# Altium schematic sheet SENSE AMP - 4 CH.SchDoc
size B; Organization: Altium Limited; Address1: L3, 12a Rodborough Rd; Address2: Frenchs Forest; Address3: NSW; Address4: Australia 2086
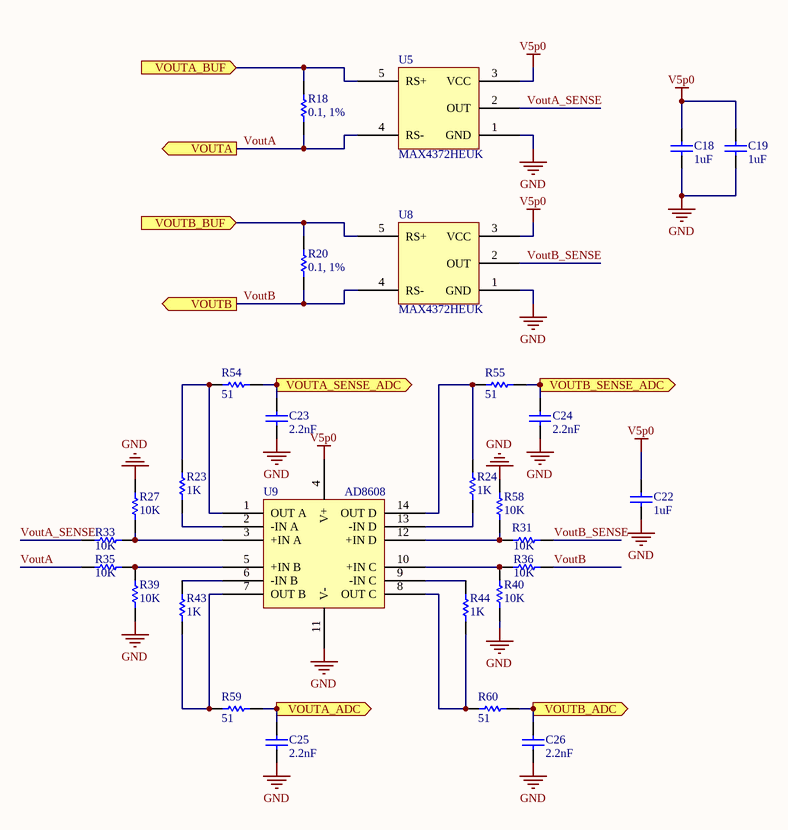
[diagram p0: SENSE AMP - 4 CH.SchDoc]

## Parts
C18  value 1uF  [CAPC01005(0402)22_N]  (hidden comment: CAP, 0402, 1uF)
C19  value 1uF  [CAPC01005(0402)22_N]  (hidden comment: CAP, 0402, 1uF)
C22  value 1uF  [CAPC01005(0402)22_N]  (hidden comment: CAP, 0402, 1uF)
C23  value 2.2nF  [CAPC01005(0402)22_N]  (hidden comment: CAP, 0402, 2.2nF)
C24  value 2.2nF  [CAPC01005(0402)22_N]  (hidden comment: CAP, 0402, 2.2nF)
C25  value 2.2nF  [CAPC01005(0402)22_N]  (hidden comment: CAP, 0402, 2.2nF)
C26  value 2.2nF  [CAPC01005(0402)22_N]  (hidden comment: CAP, 0402, 2.2nF)
R18  value 0.1, 1%  [RES, 0603]  (hidden comment: RES, 0603, 0.1, 1%)
R20  value 0.1, 1%  [RES, 0603]  (hidden comment: RES, 0603, 0.1, 1%)
R23  1K  [RES, 0603]
R24  1K  [RES, 0603]
R27  10K  [RES, 0603]
R31  10K  [RES, 0603]
R33  10K  [RES, 0603]
R35  10K  [RES, 0603]
R36  10K  [RES, 0603]
R39  10K  [RES, 0603]
R40  10K  [RES, 0603]
R43  1K  [RES, 0603]
R44  1K  [RES, 0603]
R54  51  [RES, 0603]
R55  51  [RES, 0603]
R58  10K  [RES, 0603]
R59  51  [RES, 0603]
R60  51  [RES, 0603]
U5  MAX4372HEUK  [SOT23-5, MAX4372H]
U8  MAX4372HEUK  [SOT23-5, MAX4372H]
U9  AD8608  [TSOP65P640X120-14N]

## Ports
VOUTA (out), VOUTA_ADC (out), VOUTA_BUF (in), VOUTA_SENSE_ADC (out), VOUTB (out), VOUTB_ADC (out), VOUTB_BUF (in), VOUTB_SENSE_ADC (out)

## Nets
GND: C18.1 C19.1 C22.1 C23.1 C24.1 C25.1 C26.1 R27.2 R39.1 R40.2 R58.1 U5.1(GND) U8.1(GND) U9.11(V-)
V5p0: C18.2 C19.2 C22.2 U5.3(VCC) U8.3(VCC) U9.4(V+)
VoutA: R18.1 R35.1 U5.4(RS-) ; port VOUTA
VOUTA_ADC: C25.2 R59.2 ; port VOUTA_ADC
VOUTA_BUF: R18.2 U5.5(RS+) ; port VOUTA_BUF
VoutA_SENSE: R33.1 U5.2(OUT)
VOUTA_SENSE_ADC: C23.2 R54.2 ; port VOUTA_SENSE_ADC
VoutB: R20.1 R36.1 U8.4(RS-) ; port VOUTB
VOUTB_ADC: C26.2 R60.2 ; port VOUTB_ADC
VOUTB_BUF: R20.2 U8.5(RS+) ; port VOUTB_BUF
VoutB_SENSE: R31.1 U8.2(OUT)
VOUTB_SENSE_ADC: C24.2 R55.2 ; port VOUTB_SENSE_ADC
NetR23_1: R23.1 U9.2(-IN_A)
NetR23_2: R23.2 R54.1 U9.1(OUT_A)
NetR24_1: R24.1 U9.13(-IN_D)
NetR24_2: R24.2 R55.1 U9.14(OUT_D)
NetR27_1: R27.1 R33.2 U9.3(+IN_A)
NetR31_2: R31.2 R58.2 U9.12(+IN_D)
NetR35_2: R35.2 R39.2 U9.5(+IN_B)
NetR36_2: R36.2 R40.1 U9.10(+IN_C)
NetR43_1: R43.1 R59.1 U9.7(OUT_B)
NetR43_2: R43.2 U9.6(-IN_B)
NetR44_1: R44.1 R60.1 U9.8(OUT_C)
NetR44_2: R44.2 U9.9(-IN_C)

## Notes on the sheet
- Title
- Size:
- Date:
- B
- Number:
- Time:
- Revision:
- Sheet
- of
- File:

## Library data of the parts
C23-C26 = CAP, 0402, 2.2nF: Manufacturer: Taiyo Yuden; Manufacturer Part Number: UMK105B7222KV-F; Capacitance: 2200pF; Voltage - Rated: 50V; Tolerance: ±10%; Temperature Coefficient: X7R; Description: CAP CER 2200PF 50V 10% X7R 0402; Packaging: Cut Tape (CT); Mounting Type: Surface Mount, MLCC; Operating Temperature: -55°C ~ 125°C; Applications: General Purpose; Ratings: -; Package / Case: 0402 (1005 Metric); Size / Dimension: 0.039" L x 0.020" W (1.00mm x 0.50mm); Height - Seated (Max): -; Thickness (Max): 0.022" (0.55mm); Lead Spacing: -; Features: -; Lead Style: -; ComponentLink1URL: http://www.yuden.co.jp/or/product/category/capacitor/UMK105B7222KV-F.pdf; ComponentLink1Description: http://www.yuden.co.jp/or/product/category/capacitor/UMK105B7222KV-F.pdf; Supplier 1: Digi-Key; Supplier Part Number 1: 587-1221-1-ND; RoHS: RoHS Compliant; Category: Capacitors; Stock 1: 180048; Pricing 1: 1=0.1, 10=0.014, 50=0.0078, 100=0.0066, 250=0.0054, 500=0.00462, 1000=0.0036, 5000=0.003 (USD)
R18 R20 = RES, 0603, 0.1, 1%: Manufacturer: Panasonic Electronic Components; Manufacturer Part Number: ERJ-3RSFR10V; Resistance (Ohms): 0.1; Power (Watts): 0.1W, 1/10W; Temperature Coefficient: ±300ppm/°C; Description: RES 0.1 OHM 1/10W 1% 0603 SMD; Packaging: Cut Tape (CT); Tolerance: ±1%; Composition: Thick Film; Features: -; Package / Case: 0603 (1608 Metric); Supplier Device Package: 0603; Size / Dimension: 0.063" L x 0.031" W (1.60mm x 0.80mm); Height: 0.022" (0.55mm); Number of Terminations: 2; ComponentLink1URL: http://industrial.panasonic.com/www-cgi/jvcr13pz.cgi?E+PZ+3+AOA0003+ERJ3RSFR10V+7+WW; ComponentLink1Description: http://industrial.panasonic.com/www-cgi/jvcr13pz.cgi?E+PZ+3+AOA0003+ERJ3RSFR10V+7+WW; Supplier 1: Digi-Key; Supplier Part Number 1: P.10AJCT-ND; RoHS: RoHS Compliant; Category: Resistors; Stock 1: 81086; Pricing 1: 1=0.48, 50=0.1898, 100=0.1465, 250=0.11392, 500=0.0803, 1000=0.05859 (USD)
R23 R24 R43 R44 = RES_0603_1K: Resistor, 0603, 1/10W, 1K ohm; Manufacturer: Panasonic Electronic Components; Manufacturer Part Number: ERJ-3EKF1001V; Description: RES 1K OHM 1/10W 1% 0603 SMD; Tolerance: ±1%; Power (Watts): 0.1W, 1/10W; Temperature Coefficient: ±100ppm/°C; Supplier 1: Digi-Key; RoHS: RoHS Compliant; Category: Resistors; Stock 1: 3447685; Pricing 1: 1=0.1, 50=0.0138, 100=0.0105, 250=0.0078, 500=0.00576, 1000=0.00384 (USD); Packaging: Cut Tape (CT); Resistance (Ohms): 1k; Composition: Thick Film; Features: -; Package / Case: 0603 (1608 Metric); Supplier Device Package: 0603; Size / Dimension: 0.063" L x 0.031" W (1.60mm x 0.80mm); Height: 0.022" (0.55mm); Number of Terminations: 2; ComponentLink1URL: http://industrial.panasonic.com/www-cgi/jvcr13pz.cgi?E+PZ+3+AOA0002+ERJ3EKF1001V+7+WW; ComponentLink1Description: http://industrial.panasonic.com/www-cgi/jvcr13pz.cgi?E+PZ+3+AOA0002+ERJ3EKF1001V+7+WW; Supplier Part Number 1: P1.00KHCT-ND
R27 R31 R33 R35 R36 R39 R40 R58 = RES_0603_10K: Resistor, 0603, 1/10W, 10K ohm; Manufacturer: Panasonic Electronic Components; Manufacturer Part Number: ERJ-3EKF1002V; Description: RES 10K OHM 1/10W 1% 0603 SMD; Tolerance: ±1%; Power (Watts): 0.1W, 1/10W; Temperature Coefficient: ±100ppm/°C; Supplier 1: Digi-Key; RoHS: RoHS Compliant; Category: Resistors; Stock 1: 4631019; Pricing 1: 1=0.1, 50=0.0138, 100=0.0105, 250=0.0078, 500=0.00576, 1000=0.00384 (USD); Packaging: Cut Tape (CT); Resistance (Ohms): 10k; Composition: Thick Film; Features: -; Package / Case: 0603 (1608 Metric); Supplier Device Package: 0603; Size / Dimension: 0.063" L x 0.031" W (1.60mm x 0.80mm); Height: 0.022" (0.55mm); Number of Terminations: 2; ComponentLink1URL: http://industrial.panasonic.com/www-cgi/jvcr13pz.cgi?E+PZ+3+AOA0002+ERJ3EKF1002V+7+WW; ComponentLink1Description: http://industrial.panasonic.com/www-cgi/jvcr13pz.cgi?E+PZ+3+AOA0002+ERJ3EKF1002V+7+WW; Supplier Part Number 1: P10.0KHCT-ND
R54 R55 R59 R60 = RES_0603_51: Resistor, 0603, 1/10W, 51 ohm; Manufacturer: Panasonic Electronic Components; Manufacturer Part Number: ERJ-3EKF51R0V; Description: RES 51 OHM 1/10W 1% 0603 SMD; Tolerance: ±1%; Power (Watts): 0.1W, 1/10W; Temperature Coefficient: ±100ppm/°C; Supplier 1: Digi-Key; RoHS: RoHS Compliant; Category: Resistors; Stock 1: 80502; Pricing 1: 1=0.1, 50=0.0138, 100=0.0105, 250=0.0078, 500=0.00576, 1000=0.00384 (USD); Packaging: Cut Tape (CT); Resistance (Ohms): 51; Composition: Thick Film; Features: -; Package / Case: 0603 (1608 Metric); Supplier Device Package: 0603; Size / Dimension: 0.063" L x 0.031" W (1.60mm x 0.80mm); Height: 0.022" (0.55mm); Number of Terminations: 2; ComponentLink1URL: http://industrial.panasonic.com/www-cgi/jvcr13pz.cgi?E+PZ+3+AOA0002+ERJ3EKF51R0V+7+WW; ComponentLink1Description: http://industrial.panasonic.com/www-cgi/jvcr13pz.cgi?E+PZ+3+AOA0002+ERJ3EKF51R0V+7+WW; Supplier Part Number 1: P51.0HCT-ND
U5 U8 = MAX4372H, Current-Sense, SOT23: Manufacturer: Maxim; Manufacturer PN: MAX4372HEUK+T; Supplier: Digikey; Supplier PN: MAX4372HEUK_TCT-ND; Supplier link: http://www.digikey.com/product-detail/en/MAX4372HEUK%2BT/MAX4372HEUK%2BTCT-ND/2234345; Unit price: 1.97
U9 = AD8608: Quad Op-Amp; Manufacturer: Analog Devices Inc; Manufacturer Part Number: AD8608ARZ-REEL; Amplifier Type: General Purpose; Number of Circuits: 4; Output Type: Rail-to-Rail; Slew Rate: 5 V/µs; Gain Bandwidth Product: 10MHz; Current - Input Bias: 0.2pA; Voltage - Input Offset: 80µV; Current - Supply: 1mA; Current - Output / Channel: 80mA; Voltage - Supply, Single/Dual (±): 2.7 V ~ 5.5 V; Description: IC OPAMP GP 10MHZ RRO 14SOIC; Packaging: Cut Tape (CT); -3db Bandwidth: -; Operating Temperature: -40°C ~ 125°C; Mounting Type: Surface Mount; Package / Case: 14-SOIC (0.154", 3.90mm Width); Supplier Device Package: 14-SOIC; ComponentLink1URL: http://www.analog.com/static/imported-files/data_sheets/AD8605_8606_8608.pdf; ComponentLink1Description: http://www.analog.com/static/imported-files/data_sheets/AD8605_8606_8608.pdf; Supplier 1: Digi-Key; Supplier Part Number 1: AD8608ARZ-REELCT-ND; RoHS: RoHS Compliant; Stock 1: 2419; Pricing 1: 1=4.22, 10=3.785, 25=3.4036, 100=3.0954, 250=2.80196, 500=2.50858, 1000=2.11248 (USD); Category: Integrated Circuits (ICs)
C18 C19 C22 = CAP, 0402, 1uF: Supplier 1: Digi-Key; Supplier Part Number 1: 587-3245-1-ND